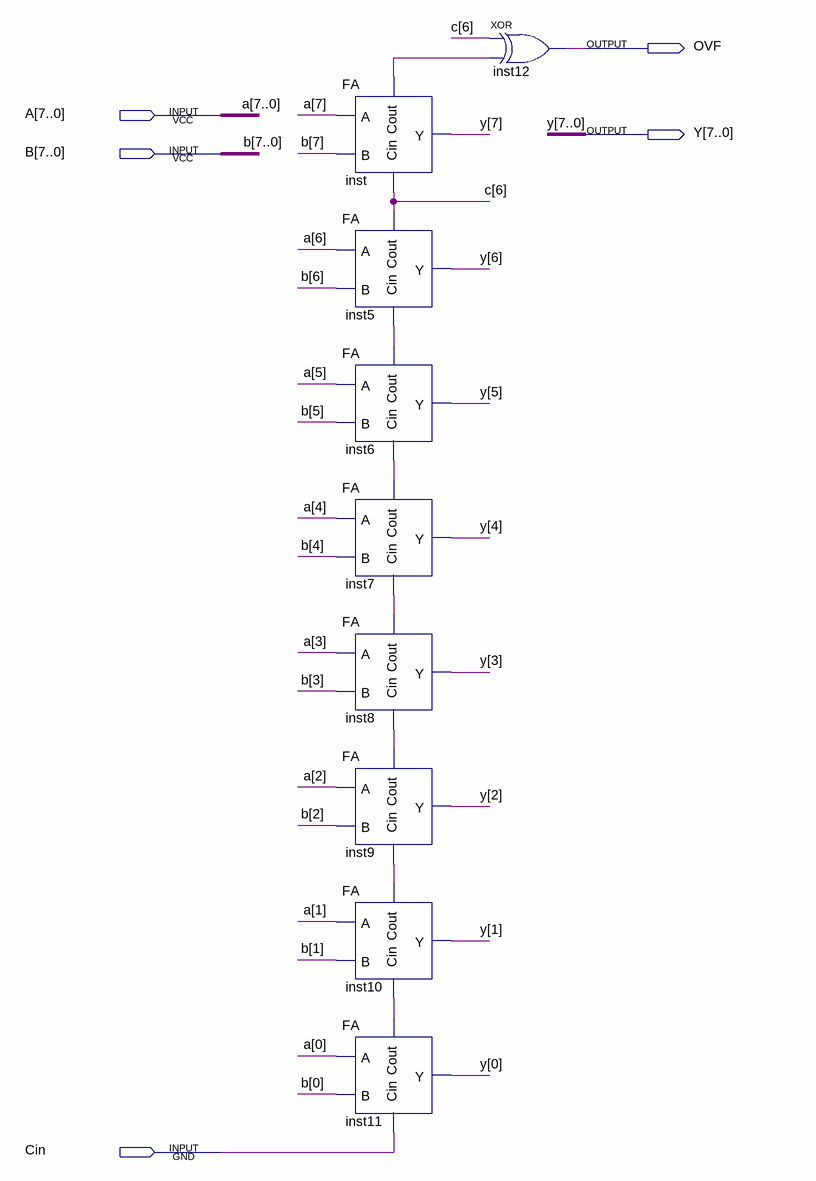
[diagram p0: schematic sheet]
// Quartus schematic ADD.bdf as structural Verilog: 9 symbols, 5 pins
module ADD (
  input  [7:0] A,
  input  [7:0] B,
  input  Cin,
  output OVF,
  output [7:0] Y
);

  wire inst6_cout, inst7_cout, inst8_cout, inst9_cout, inst10_cout, inst11_cout, inst_cout;
  wire [6:6] c;

  FA inst (.A(A[7]), .B(B[7]), .Cin(c[6]), .Y(Y[7]), .Cout(inst_cout));
  FA inst5 (.A(A[6]), .B(B[6]), .Cin(inst6_cout), .Y(Y[6]), .Cout(c[6]));
  FA inst6 (.A(A[5]), .B(B[5]), .Cin(inst7_cout), .Y(Y[5]), .Cout(inst6_cout));
  FA inst7 (.A(A[4]), .B(B[4]), .Cin(inst8_cout), .Y(Y[4]), .Cout(inst7_cout));
  FA inst8 (.A(A[3]), .B(B[3]), .Cin(inst9_cout), .Y(Y[3]), .Cout(inst8_cout));
  FA inst9 (.A(A[2]), .B(B[2]), .Cin(inst10_cout), .Y(Y[2]), .Cout(inst9_cout));
  FA inst10 (.A(A[1]), .B(B[1]), .Cin(inst11_cout), .Y(Y[1]), .Cout(inst10_cout));
  FA inst11 (.A(A[0]), .B(B[0]), .Cin(Cin), .Y(Y[0]), .Cout(inst11_cout));
  xor inst12 (OVF, c[6], inst_cout);
endmodule
